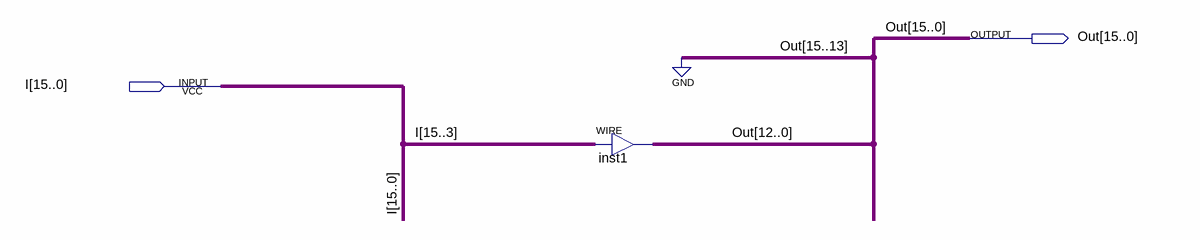
[diagram p0: schematic sheet]
// Quartus schematic SHR3.bdf as structural Verilog: 1 symbols, 2 pins
module SHR3 (
  input  [15:0] I,
  output [15:0] Out
);

  assign Out[12:0] = I[15:3];  // WIRE inst1

  assign Out[15:13] = 3'b000;
endmodule
